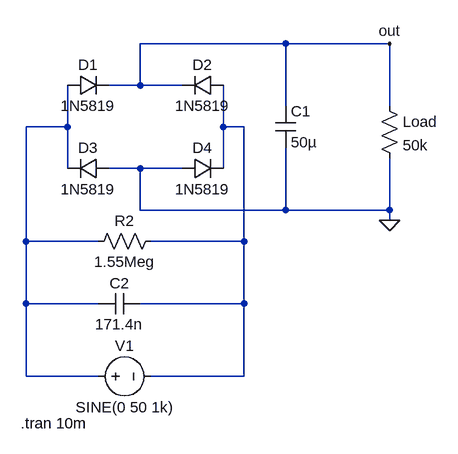
[diagram p0: schematic AC-DC Regulator.asc]
AC-DC Regulator.asc, the LTspice schematic file:
Version 4.1
SHEET 1 880 680
WIRE 416 80 192 80
WIRE 576 80 416 80
WIRE 192 144 192 80
WIRE 192 144 144 144
WIRE 256 144 192 144
WIRE 416 176 416 80
WIRE 576 176 576 80
WIRE 80 208 80 144
WIRE 80 208 16 208
WIRE 320 208 320 144
WIRE 352 208 320 208
WIRE 80 272 80 208
WIRE 192 272 144 272
WIRE 256 272 192 272
WIRE 320 272 320 208
WIRE 192 336 192 272
WIRE 416 336 416 240
WIRE 416 336 192 336
WIRE 576 336 576 256
WIRE 576 336 416 336
WIRE 576 352 576 336
WIRE 16 384 16 208
WIRE 128 384 16 384
WIRE 352 384 352 208
WIRE 352 384 208 384
WIRE 16 480 16 384
WIRE 128 480 16 480
WIRE 352 480 352 384
WIRE 352 480 192 480
WIRE 16 592 16 480
WIRE 128 592 16 592
WIRE 352 592 352 480
WIRE 352 592 208 592
FLAG 576 352 0
FLAG 576 80 out
SYMBOL diode 80 160 R270
WINDOW 0 32 32 VTop 2
WINDOW 3 0 32 VBottom 2
SYMATTR InstName D1
SYMATTR Value 1N5819
SYMBOL diode 320 128 R90
WINDOW 0 0 32 VBottom 2
WINDOW 3 32 32 VTop 2
SYMATTR InstName D2
SYMATTR Value 1N5819
SYMBOL diode 144 256 R90
WINDOW 0 0 32 VBottom 2
WINDOW 3 32 32 VTop 2
SYMATTR InstName D3
SYMATTR Value 1N5819
SYMBOL diode 256 288 R270
WINDOW 0 32 32 VTop 2
WINDOW 3 0 32 VBottom 2
SYMATTR InstName D4
SYMATTR Value 1N5819
SYMBOL cap 400 176 R0
SYMATTR InstName C1
SYMATTR Value 50µ
SYMBOL res 560 160 R0
SYMATTR InstName Load
SYMATTR Value 50k
SYMBOL res 224 368 R90
WINDOW 0 0 56 VBottom 2
WINDOW 3 32 56 VTop 2
SYMATTR InstName R2
SYMATTR Value 1.55Meg
SYMBOL cap 192 464 R90
WINDOW 0 0 32 VBottom 2
WINDOW 3 32 32 VTop 2
SYMATTR InstName C2
SYMATTR Value 171.4n
SYMBOL voltage 112 592 R270
WINDOW 0 32 56 VTop 2
WINDOW 3 -32 56 VBottom 2
WINDOW 123 0 0 Left 0
WINDOW 39 0 0 Left 0
SYMATTR InstName V1
SYMATTR Value SINE(0 50 1k)
TEXT 8 664 Left 2 !.tran 10m

The netlist it stands for:
* AC-DC Regulator.asc
D1 N001 out 1N5819
D2 N002 out 1N5819
D3 0 N001 1N5819
D4 0 N002 1N5819
C1 out 0 50µ
R§Load out 0 50k
R2 N002 N001 1.55Meg
C2 N002 N001 171.4n
V1 N001 N002 SINE(0 50 1k)
.model D D
.lib standard.dio
.tran 10m
.backanno
.end